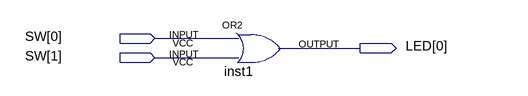
[diagram p0: schematic sheet]
// Quartus schematic lab2.bdf as structural Verilog: 1 symbols, 3 pins
module lab2 (
  input  [1:0] SW,
  output [0:0] LED
);

  or inst1 (LED[0], SW[0], SW[1]);
endmodule
